# Altium schematic sheet AC56I99.RWA.230731.SchDoc
size 838 x 457 mm
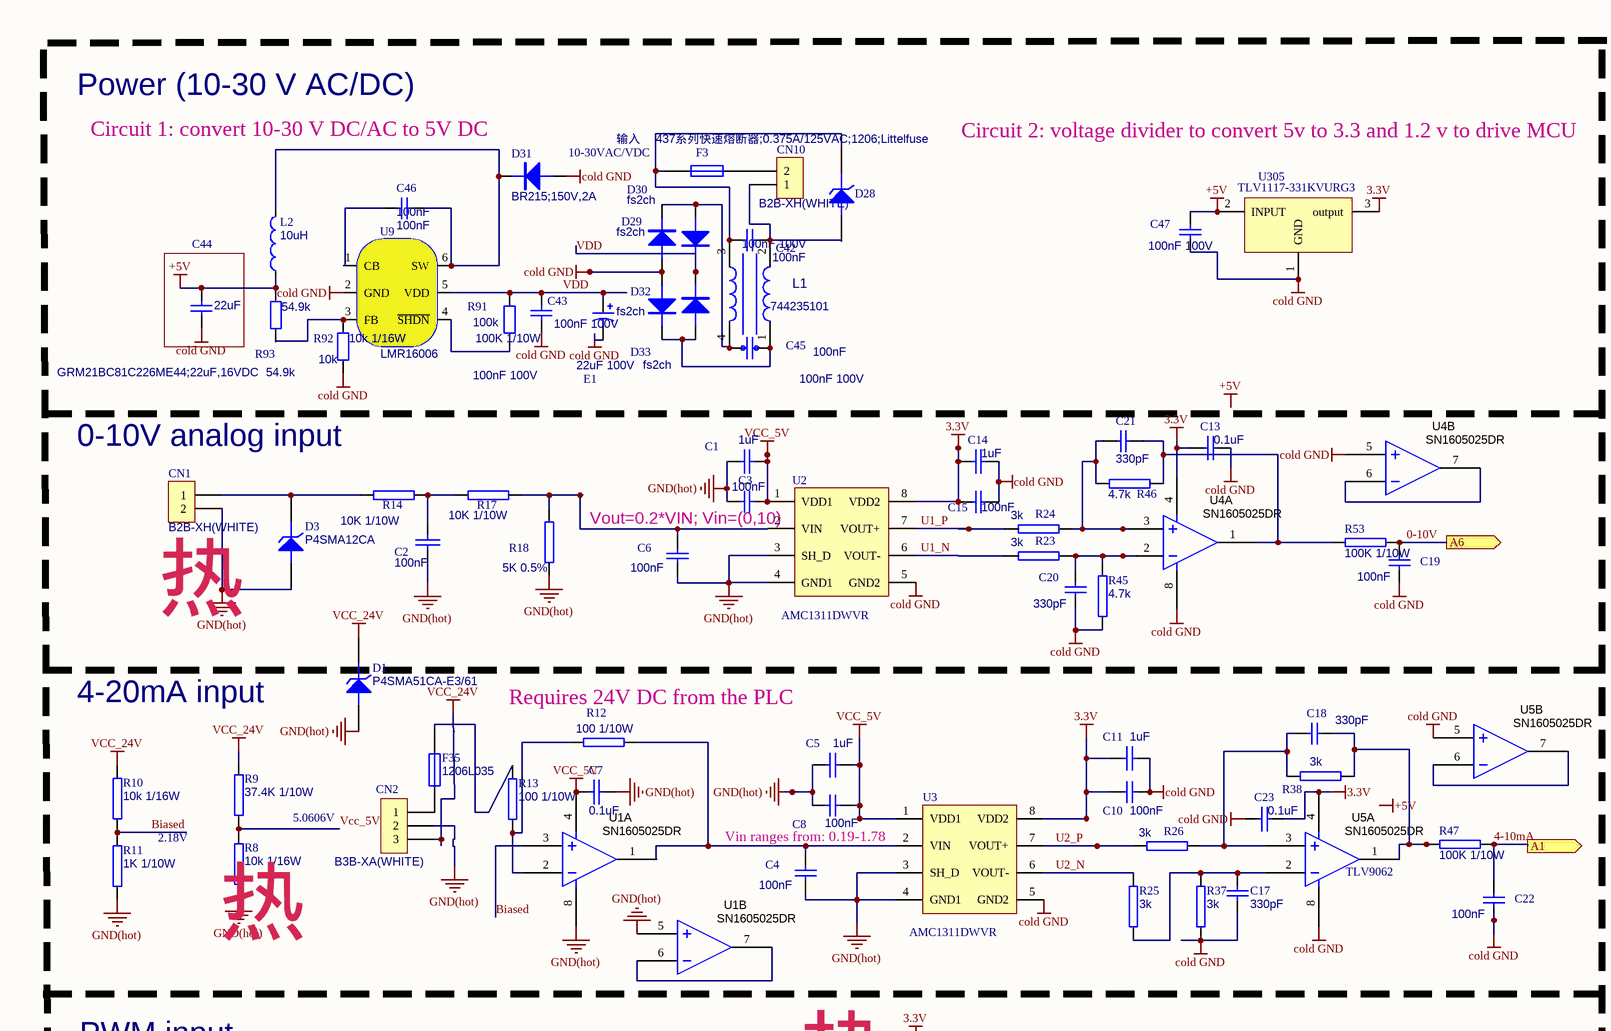
[diagram p0: AC56I99.RWA.230731.SchDoc, top left]
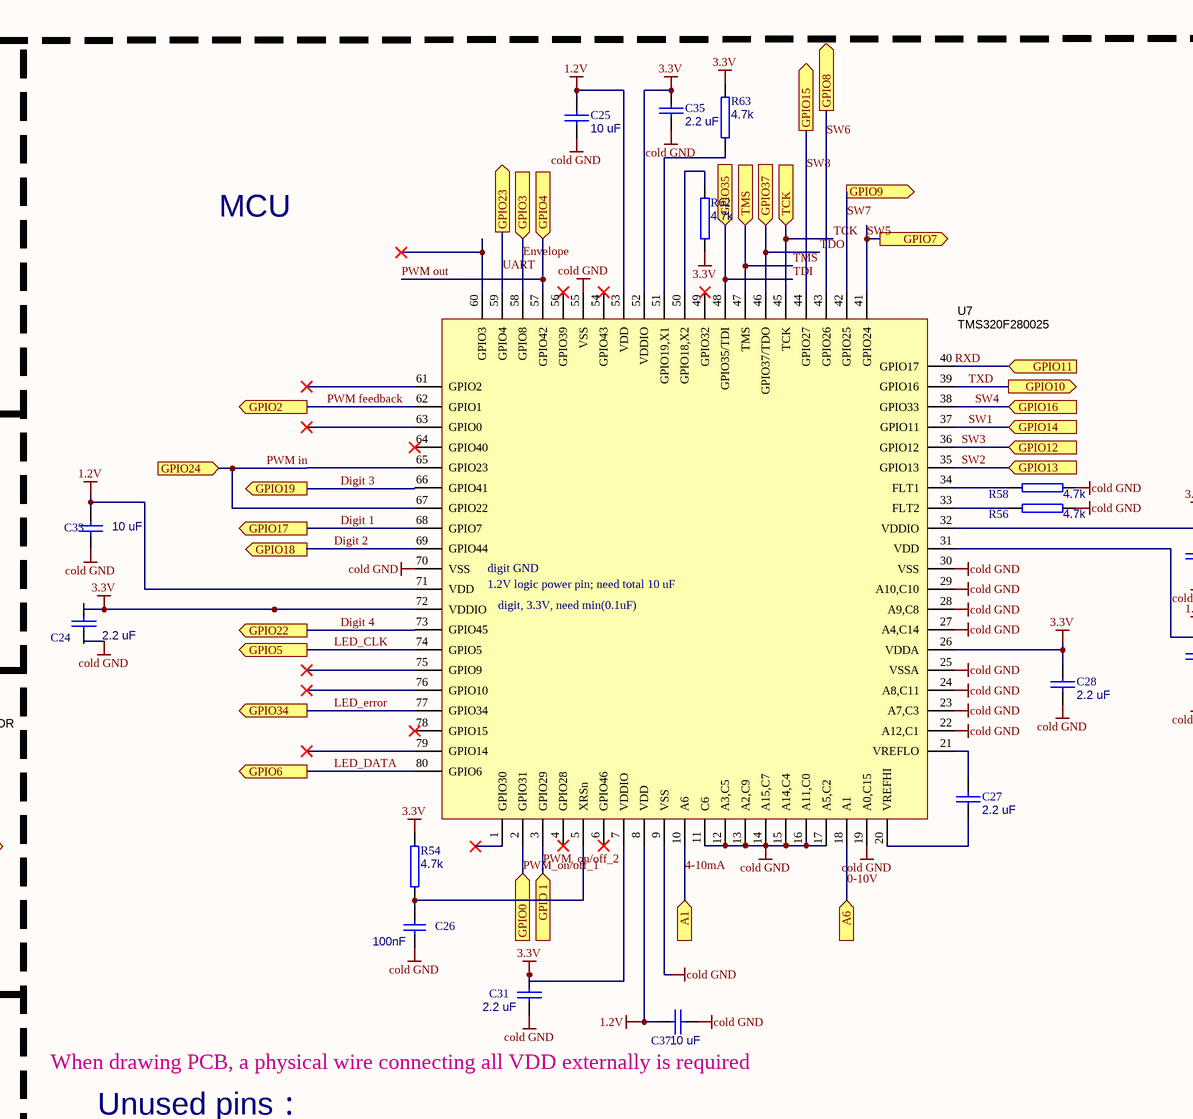
[diagram p1: AC56I99.RWA.230731.SchDoc, top middle]
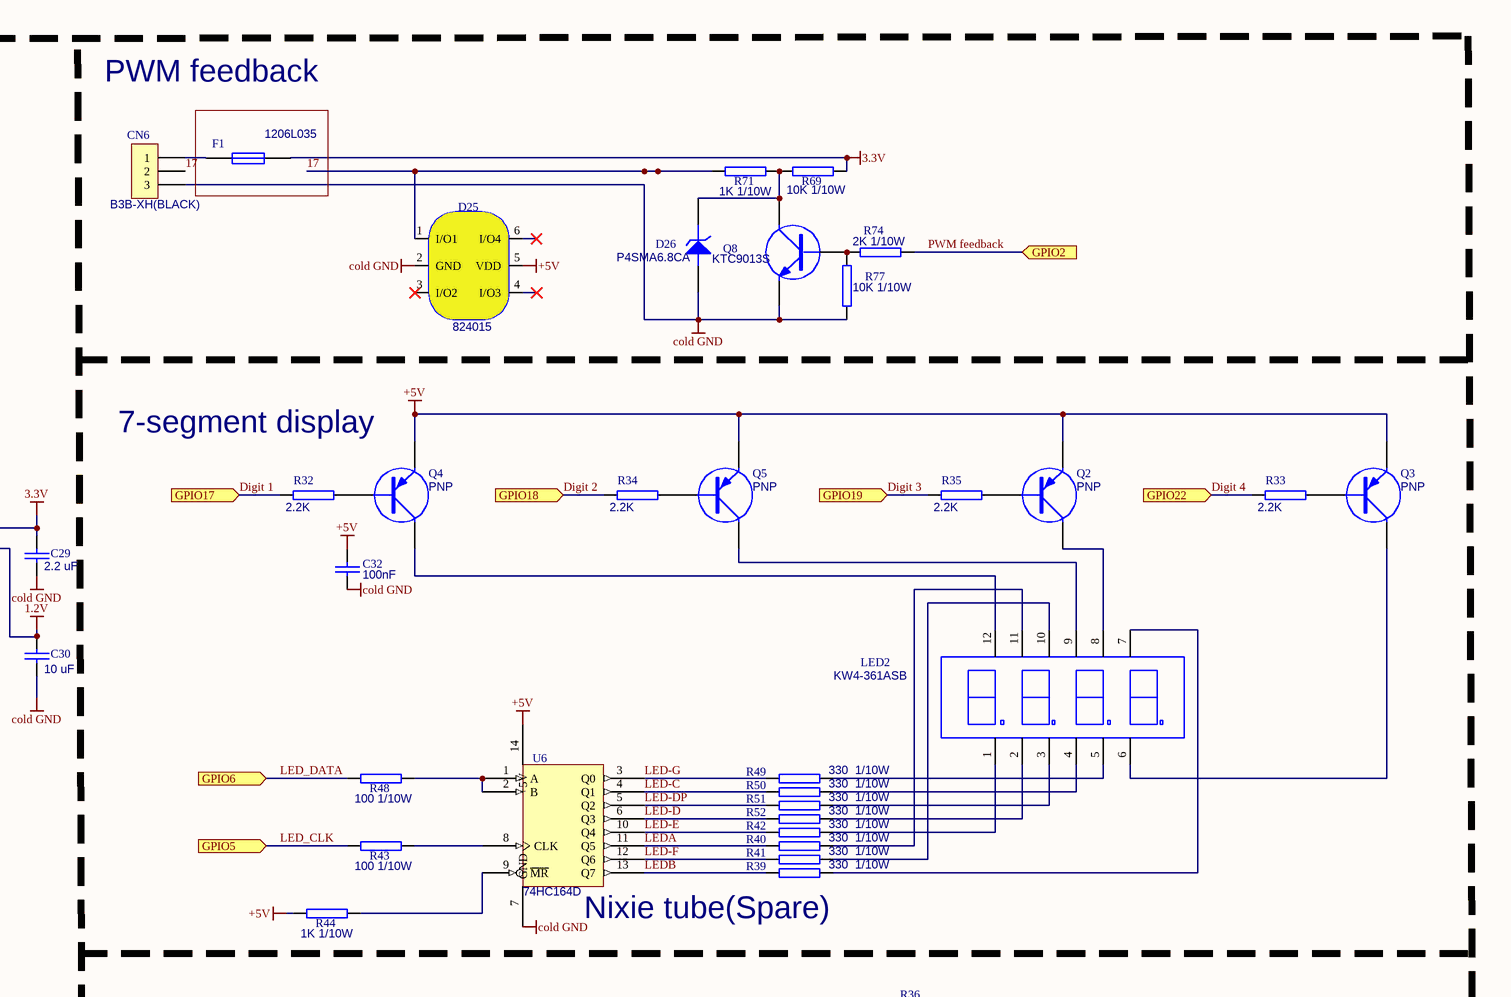
[diagram p2: AC56I99.RWA.230731.SchDoc, top right]
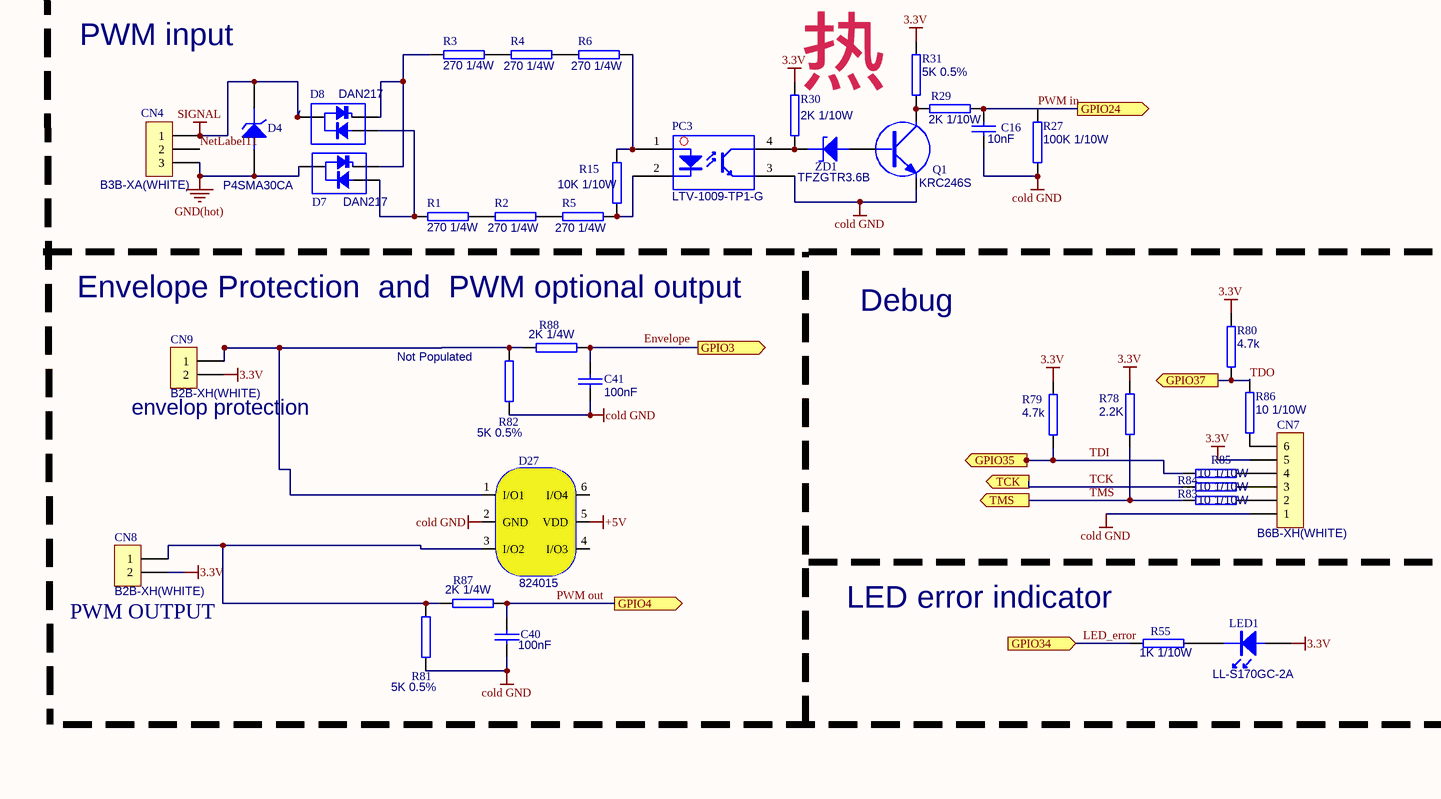
[diagram p3: AC56I99.RWA.230731.SchDoc, bottom left]
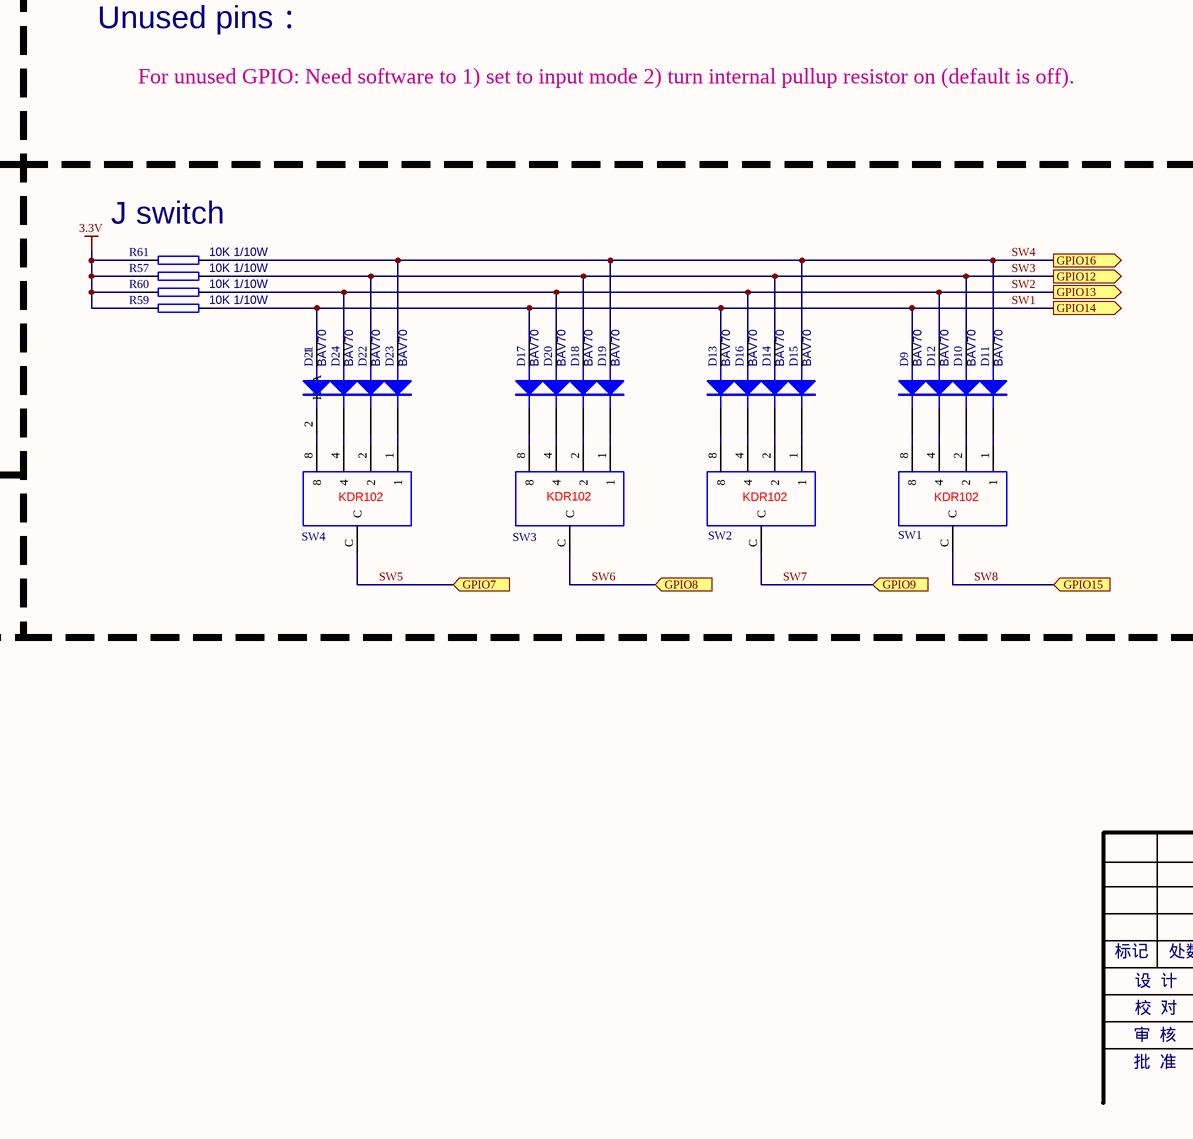
[diagram p4: AC56I99.RWA.230731.SchDoc, bottom middle]
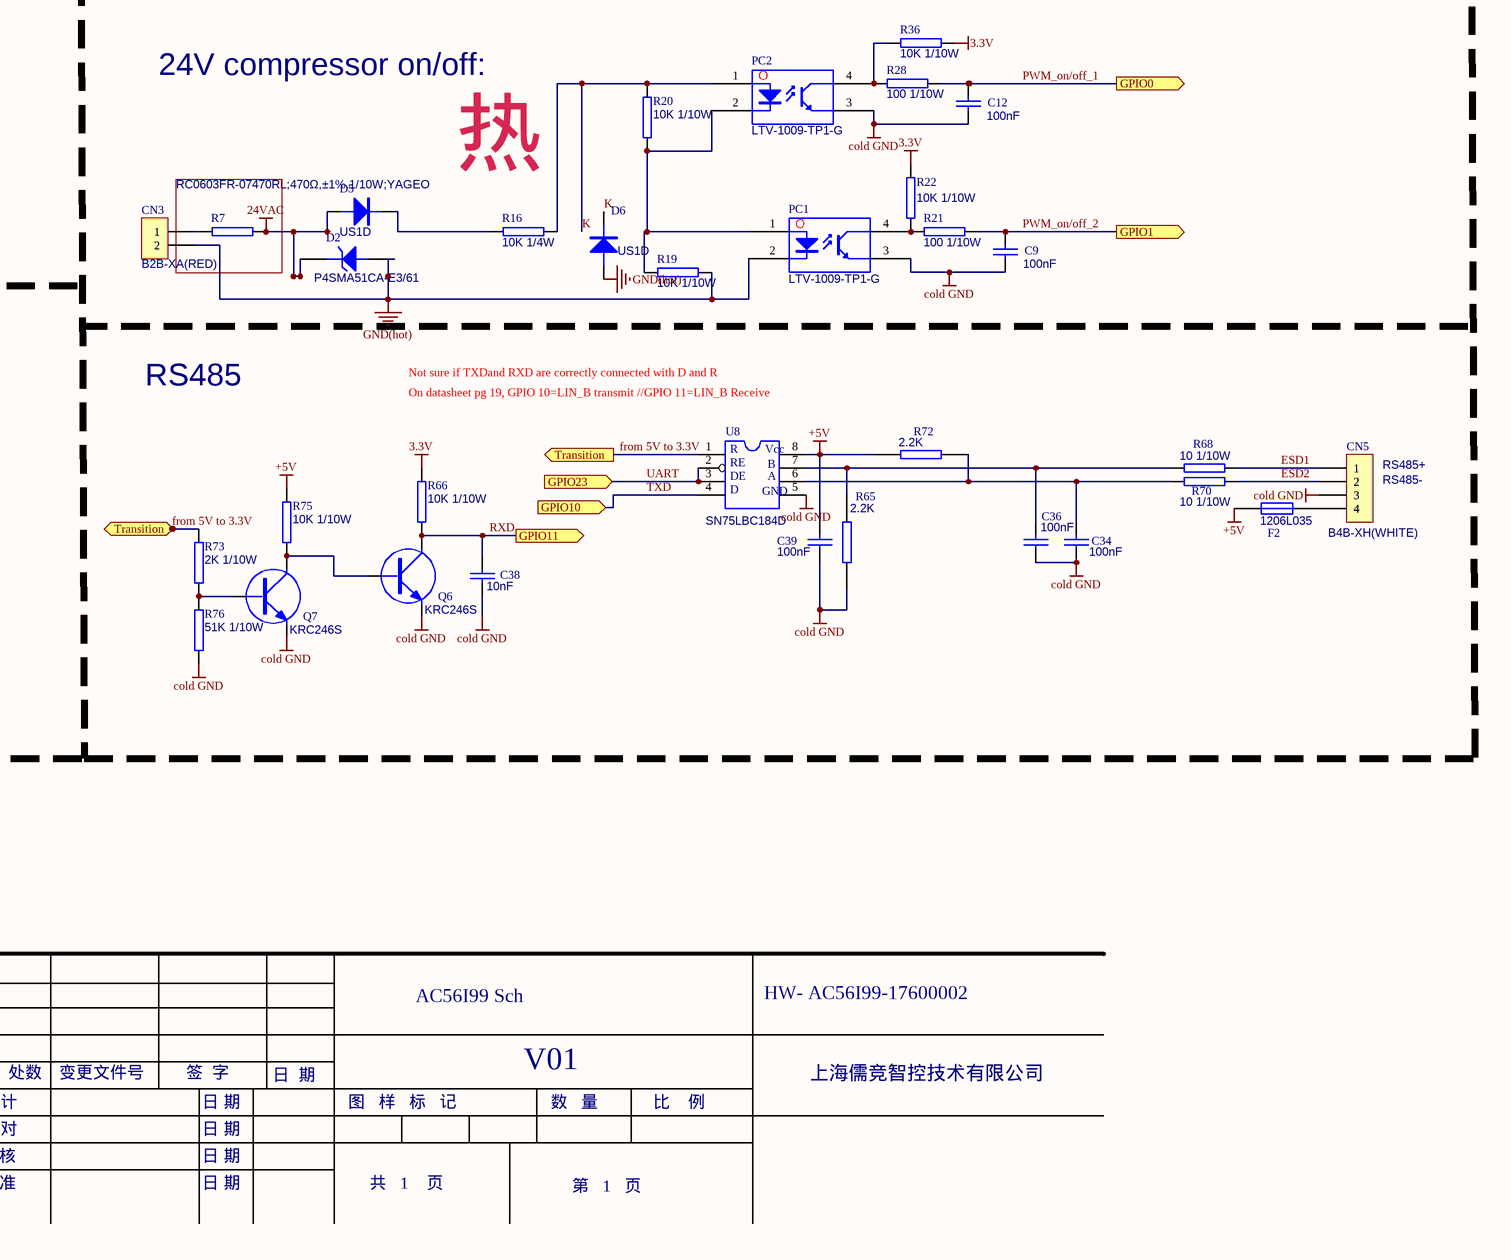
[diagram p5: AC56I99.RWA.230731.SchDoc, bottom right]

## Parts
C1  1uF  [0805-1]
C2  100nF  [0603-1]
C3  100nF  [0603-1]
C4  100nF  [0603-1]
C5  1uF  [0805-1]
C6  100nF  [0603-1]
C7  0.1uF  [0603-1]
C8  100nF  [0603-1]
C9  100nF  [0603-1]
C10  100nF  [0603-1]
C11  1uF  [0805-1]
C12  100nF  [0603-1]
C13  0.1uF  [0603-1]
C14  1uF  [0805-1]
C15  100nF  [0603-1]
C16  10nF  [0603-1]
C17  330pF  [0603-1]
C18  330pF  [0603-1]
C19  100nF  [0603-1]
C20  330pF  [0603-1]
C21  330pF  [0603-1]
C22  100nF  [0603-1]
C23  0.1uF  [0603-1]
C24  2.2 uF  [0603-1]
C25  10 uF  [0603-1]
C26  100nF  [0603-1]
C27  2.2 uF  [0603-1]
C28  2.2 uF  [0603-1]
C29  2.2 uF  [0603-1]
C30  10 uF  [0603-1]
C31  2.2 uF  [0603-1]
C32  100nF  [0603-1]
C33  10 uF  [0603-1]
C34  100nF  [0603-1]
C35  2.2 uF  [0603-1]
C36  100nF  [0603-1]
C37  10 uF  [0603-1]
C38  10nF  [0603-1]
C39  100nF  [0603-1]
C40  100nF  [0603-1]
C41  100nF  [0603-1]
C42  100nF 100V  value 100nF  [0805]
C43  100nF 100V  [0805]
C44  22uF  value GRM21BC81C226ME44;22uF,16VDC  [0805]
C45  100nF 100V  value 100nF  [0805]
C46  100nF  [0603-1]
C47  100nF 100V  [0805]
CN1  B2B-XH(WHITE)  [XH-2-1]
CN2  B3B-XA(WHITE)  [XH-3-1]
CN3  B2B-XA(RED)  [XH-2-1]
CN4  B3B-XA(WHITE)  [XH-3-1]
CN5  B4B-XH(WHITE)  [XH-4]
CN6  B3B-XH(BLACK)  [XH-3-1]
CN7  B6B-XH(WHITE)  [XH-6-1]
CN8  B2B-XH(WHITE)  [XH-2]
CN9  B2B-XH(WHITE)  [XH-2]
CN10  B2B-XH(WHITE)  [XH-2]
D1  P4SMA51CA-E3/61  [DIOD2]
D2  P4SMA51CA-E3/61  [DIOD2]
D3  P4SMA12CA  [DIOD2]
D4  P4SMA30CA  [DIOD2]
D5  US1D  [DIOD2]
D6  US1D  [DIOD2]
D7  DAN217  [SMD3]
D8  DAN217  [SMD3]
D9  BAV70  [SOT22-1]
D10  BAV70  [SOT22-1]
D11  BAV70  [SOT22-1]
D12  BAV70  [SOT22-1]
D13  BAV70  [SOT22-1]
D14  BAV70  [SOT22-1]
D15  BAV70  [SOT22-1]
D16  BAV70  [SOT22-1]
D17  BAV70  [SOT22-1]
D18  BAV70  [SOT22-1]
D19  BAV70  [SOT22-1]
D20  BAV70  [SOT22-1]
D21  BAV70  [SOT22-1]
D22  BAV70  [SOT22-1]
D23  BAV70  [SOT22-1]
D24  BAV70  [SOT22-1]
D25  824015  [SOT23-6L]
D26  P4SMA6.8CA  [DIOD2]
D27  824015  [SOT23-6L]
D28  (no value)  [DIOD2]
D29  fs2ch  [diod2]
D30  fs2ch  [DIOD2]
D31  BR215;150V,2A  [DIOD2]
D32  fs2ch  [DIOD2]
D33  fs2ch  [DIOD2]
E1  value 22uF 100V  [E8T1]
F1  1206L035  [1206]
F2  1206L035  [1206]
F3  437系列快速熔断器;0.375A/125VAC;1206;Littelfuse  [1206]
F35  1206L035  [1206]
L1  744235101  [744235101]
L2  10uH  [0806]
LED1  LL-S170GC-2A  [LED0805-1]
LED2  KW4-361ASB  [KW4-361ASB]
PC1  LTV-1009-TP1-G  [SOIC-4-Long]
PC2  LTV-1009-TP1-G  [SOIC-4-Long]
PC3  LTV-1009-TP1-G  [SOIC-4-Long]
Q1  KRC246S  [SOT-NPN]
Q2  PNP  [SOT-PNP]
Q3  PNP  [SOT-PNP]
Q4  PNP  [SOT-PNP]
Q5  PNP  [SOT-PNP]
Q6  KRC246S  [SOT-NPN]
Q7  KRC246S  [SOT-NPN]
Q8  KTC9013S  [SOT-NPN]
R1  270 1/4W  [1206]
R2  270 1/4W  [1206]
R3  270 1/4W  [1206]
R4  270 1/4W  [1206]
R5  270 1/4W  [1206]
R6  270 1/4W  [1206]
R7  RC0603FR-07470RL;470Ω,±1%,1/10W;YAGEO  [0603-1]
R8  10k 1/16W  [0603-1]
R9  37.4K 1/10W  [0603-1]
R10  10k 1/16W  [0603-1]
R11  1K 1/10W  [0603-1]
R12  100 1/10W  [0603-1]
R13  100 1/10W  [0603-1]
R14  10K 1/10W  [0603-1]
R15  10K 1/10W  [0603-1]
R16  10K 1/4W  [1206]
R17  10K 1/10W  [0603-1]
R18  5K 0.5%  [0603-1]
R19  10K 1/10W  [0603-1]
R20  10K 1/10W  [0603-1]
R21  100 1/10W  [0603-1]
R22  10K 1/10W  [0603-1]
R23  3k  [0603-1]
R24  3k  [0603-1]
R25  3k  [0603-1]
R26  3k  [0603-1]
R27  100K 1/10W  [0603-1]
R28  100 1/10W  [0603-1]
R29  2K 1/10W  [0603-1]
R30  2K 1/10W  [0603-1]
R31  5K 0.5%  [0603-1]
R32  2.2K  [0603-1]
R33  2.2K  [0603-1]
R34  2.2K  [0603-1]
R35  2.2K  [0603-1]
R36  10K 1/10W  [0603-1]
R37  3k  [0603-1]
R38  3k  [0603-1]
R39  330  1/10W  [0603-1]
R40  330  1/10W  [0603-1]
R41  330  1/10W  [0603-1]
R42  330  1/10W  [0603-1]
R43  100 1/10W  [0603-1]
R44  1K 1/10W  [0603-1]
R45  4.7k  [0603-1]
R46  4.7k  [0603-1]
R47  100K 1/10W  [0603-1]
R48  100 1/10W  [0603-1]
R49  330  1/10W  [0603-1]
R50  330  1/10W  [0603-1]
R51  330  1/10W  [0603-1]
R52  330  1/10W  [0603-1]
R53  100K 1/10W  [0603-1]
R54  4.7k  [0603-1]
R55  1K 1/10W  [0603-1]
R56  4.7k  [0603-1]
R57  10K 1/10W  [0603-1]
R58  4.7k  [0603-1]
R59  10K 1/10W  [0603-1]
R60  10K 1/10W  [0603-1]
R61  10K 1/10W  [0603-1]
R62  4.7k  [0603-1]
R63  4.7k  [0603-1]
R65  2.2K  [0603-1]
R66  10K 1/10W  [0603-1]
R68  10 1/10W  [0603-1]
R69  10K 1/10W  [0603-1]
R70  10 1/10W  [0603-1]
R71  1K 1/10W  [0603-1]
R72  2.2K  [0603-1]
R73  2K 1/10W  [0603-1]
R74  2K 1/10W  [0603-1]
R75  10K 1/10W  [0603-1]
R76  51K 1/10W  [0603-1]
R77  10K 1/10W  [0603-1]
R78  2.2K  [0603-1]
R79  4.7k  [0603-1]
R80  4.7k  [0603-1]
R81  5K 0.5%  [0603-1]
R82  5K 0.5%  [0603-1]
R83  10 1/10W  [0603-1]
R84  10 1/10W  [0603-1]
R85  10 1/10W  [0603-1]
R86  10 1/10W  [0603-1]
R87  2K 1/4W  [1206]
R88  2K 1/4W  [1206]
R91  100K 1/10W  value 100k  [0603-1]
R92  10k 1/16W  value 10k  [0603-1]
R93  54.9k  [0603-1]
SW1  KDR102  [KDR102*]
SW2  KDR102  [KDR102*]
SW3  KDR102  [KDR102*]
SW4  KDR102  [KDR102*]
U1  SN1605025DR  [SOIC-8]  (parts A,B of 2)
U2  AMC1311DWVR  [SOIC8-9mm]
U3  AMC1311DWVR  [SOIC8-9mm]
U4  SN1605025DR  [SOIC-8]  (parts A,B of 2)
U5  SN1605025DR  [SOIC-8]  (parts A,B of 2)
U6  74HC164D  [DIP14T]
U7  TMS320F280025  [LQFP80]
U8  SN75LBC184D  [soic8]
U9  LMR16006  [SOT23-6]
U305  TLV1117-331KVURG3  [TO-252]
ZD1  TFZGTR3.6B  [TFZ]

## Ports
A1 (in), A1 (out), A6 (in), A6 (out), GPIO0 (in), GPIO0 (out), GPIO1 (out), GPIO2 (in), GPIO2 (out), GPIO3 (in), GPIO3 (out), GPIO4 (in), GPIO4 (out), GPIO5 (in), GPIO5 (out), GPIO6 (in), GPIO6 (out), GPIO7 (in), GPIO7 (out), GPIO8 (in), GPIO8 (out), GPIO9 (in), GPIO9 (out), GPIO10 (in), GPIO10 (out), GPIO11 (in), GPIO11 (out), GPIO12 (in), GPIO12 (out), GPIO13 (in), GPIO13 (out), GPIO14 (in), GPIO14 (out), GPIO15 (in), GPIO15 (out), GPIO16 (in), GPIO16 (out), GPIO17 (in), GPIO17 (out), GPIO18 (in), GPIO18 (out), GPIO19 (in), GPIO19 (out), GPIO22 (in), GPIO22 (out), GPIO23 (in), GPIO23 (out), GPIO24 (in), GPIO24 (out), GPIO34 (in), GPIO34 (out), GPIO35 (in), GPIO35 (out), GPIO37 (in), GPIO37 (out), GPIO 1 (in), TCK (in), TCK (out), TMS (in), TMS (out), Transition (in), Transition (out)

## Nets
1.2V: C25.2 C30.2 C33.1 C37.1 U7.8(VDD) U7.31(VDD) U7.53(VDD) U7.71(VDD)
3.3V: C10.1 C11.1 C13.1 C14.1 C15.1 C23.2 C24.1 C28.2 C29.2 C31.1 C35.2 CN7.5 CN8.2 CN9.2 F1.2 LED1.A(nfdhfdg) R22.1 R30.1 R31.2 R36.2 R54.2 R57.2 R59.2 R60.2 R61.2 R62.2 R63.2 R66.2 R69.2 R78.2 R79.2 R80.2 U2.8(VDD2) U3.8(VDD2) U4.4 U5.4 U7.7(VDDIO) U7.26(VDDA) U7.32(VDDIO) U7.52(VDDIO) U7.72(VDDIO) U305.3(output)
24VAC: D2.K(A) D5.A R7.2
+5V: C32.1 C39.1 C44.1 C47.1 D25.5(VDD) D27.5(VDD) F2.1 L2.1 Q2.E Q3.E Q4.E Q5.E R44.1 R72.2 R75.2 R93.2 U6.14(+5V) U8.8 U305.2(INPUT)
cold GND: C9.2 C10.2 C11.2 C12.2 C13.2 C14.2 C15.2 C16.2 C17.1 C19.2 C20.2 C22.2 C23.1 C24.2 C25.1 C26.2 C28.1 C29.1 C30.1 C31.2 C32.2 C33.2 C34.2 C35.1 C36.2 C37.2 C38.2 C39.2 C40.2 C41.2 C43.1 C44.2 C47.2 CN5.3 CN6.3 CN7.1 D25.2(GND) D26.A D27.2(GND) D29.A D31.A D32.A E1.2 PC1.3 PC2.3 PC3.3 Q1.E Q6.E Q7.E Q8.E R27.1 R37.2 R45.1 R56.1 R58.1 R65.1 R76.1 R77.1 R81.2 R82.2 R92.1 U2.5(GND2) U3.5(GND2) U4.5 U4.8 U5.5 U5.8 U6.7(GND) U7.9(VSS) U7.11(C6) U7.12(A3,C5) U7.13(A2,C9) U7.14(A15,C7) U7.15(A14,C4) U7.16(A11,C0) U7.17(A5,C2) U7.19(A0,C15) U7.22(A12,C1) U7.23(A7,C3) U7.24(A8,C11) U7.25(VSSA) U7.27(A4,C14) U7.28(A9,C8) U7.29(A10,C10) U7.30(VSS) U7.55(VSS) U7.70(VSS) U8.5 U9.2(GND) U305.1(GND)
GND(hot): C1.1 C2.2 C3.1 C4.1 C5.1 C6.1 C7.1 C8.1 CN1.2 CN2.2 CN3.2 CN4.3 D1.A(K) D2.A(K) D3.A D4.A D6.A D7.2(K1A2) PC1.2 R8.1 R11.1 R18.1 R19.2 U1.5 U1.8 U2.3(SH_D) U2.4(GND1) U3.3(SH_D) U3.4(GND1)
SIGNAL: CN4.1 D4.K D8.2(K1A2)
Vcc_5V: C1.2 C3.2 C5.2 C7.2 C8.2 R8.2 R9.1 U1.4 U2.1(VDD1) U3.1(VDD1)
VCC_24V: CN2.3 D1.K(A) R9.2 R10.2
0-10V: C19.1 R53.2 U7.18(A1) ; port A6
4-10mA: C22.1 R47.2 U7.10(A6) ; port A1
17: CN6.2 D25.1(I/O1) R71.1
Biased: R10.1 R11.2 U1.3
Digit 1: R32.1 U7.68(GPIO7) ; port GPIO17
Digit 2: R34.1 U7.69(GPIO44) ; port GPIO18
Digit 3: R35.1 U7.66(GPIO41) ; port GPIO19
Digit 4: R33.1 U7.73(GPIO45) ; port GPIO22
Envelope: C41.1 R88.2 U7.58(GPIO8) ; port GPIO3
ESD1: CN5.1 R68.2
ESD2: CN5.2 R70.2
from 5V to 3.3V: R73.2 U8.1 ; port Transition
K: D6.K PC2.1 R16.1 R20.1
LED-C: R50.1 U6.4(Q1)
LED-D: R52.1 U6.6(Q3)
LED-DP: R51.1 U6.5(Q2)
LED-E: R42.1 U6.10(Q4)
LED-F: R41.1 U6.12(Q6)
LED-G: R49.1 U6.3(Q0)
LED_CLK: R43.1 U7.74(GPIO5) ; port GPIO5
LED_DATA: R48.1 U7.80(GPIO6) ; port GPIO6
LED_error: R55.1 U7.77(GPIO34) ; port GPIO34
LEDA: R40.1 U6.11(Q5)
LEDB: R39.1 U6.13(Q7)
NetLabel11: CN4.2
PWM feedback: R74.1 U7.62(GPIO1) ; port GPIO2
PWM in: C16.1 R27.2 R29.2 U7.65(GPIO23) U7.67(GPIO22) ; port GPIO24
PWM out: C40.1 R87.2 U7.57(GPIO42) ; port GPIO4
PWM_on/off_1: C12.1 R28.2 U7.2(GPIO31) ; port GPIO0
PWM_on/off_2: C9.1 R21.2 U7.3(GPIO29) ; port GPIO1, port GPIO 1
RXD: C38.1 Q6.C R66.1 U7.40(GPIO17) ; port GPIO11
SW1: D9.1(A) D13.1(A) D17.1(A) D21.1(A) R59.1 U7.37(GPIO11) ; port GPIO14
SW2: D12.1(A) D16.1(A) D20.1(A) D24.1(A) R60.1 U7.35(GPIO13) ; port GPIO13
SW3: D10.1(A) D14.1(A) D18.1(A) D22.1(A) R57.1 U7.36(GPIO12) ; port GPIO12
SW4: D11.1(A) D15.1(A) D19.1(A) D23.1(A) R61.1 U7.38(GPIO33) ; port GPIO16
SW5: SW4.C U7.41(GPIO24) ; port GPIO7
SW6: SW3.C U7.43(GPIO26) ; port GPIO8
SW7: SW2.C U7.42(GPIO25) ; port GPIO9
SW8: SW1.C U7.44(GPIO27) ; port GPIO15
TCK: R84.2 U7.45(TCK) ; port TCK
TDI: R79.1 R85.2 U7.48(GPIO35/TDI) ; port GPIO35
TDO: R80.1 R86.2 U7.46(GPIO37/TDO) ; port GPIO37
TMS: R78.1 R83.2 U7.47(TMS) ; port TMS
TXD: U7.39(GPIO16) U8.4 ; port GPIO10
U1_N: R23.1 U2.6(VOUT-)
U1_P: R24.1 U2.7(VOUT+)
U2_N: R25.2 U3.6(VOUT-)
U2_P: R26.1 U3.7(VOUT+)
UART: U7.59(GPIO4) U8.2 U8.3 ; port GPIO23
VDD: C43.2 D30.K D33.K E1.1 R91.2 U9.5(VDD)
NetC2_1: C2.1 R14.2 R17.1
NetC4_2: C4.2 R12.2 U1.1 U3.2(VIN)
NetC6_2: C6.2 R17.2 R18.2 U2.2(VIN)
NetC17_2: C17.2 R25.1 R37.1 U5.2
NetC18_1: C18.1 R26.2 R38.1 U5.3
NetC18_2: C18.2 R38.2 R47.1 U5.1
NetC20_1: C20.1 R23.2 R45.2 U4.2
NetC21_1: C21.1 R24.2 R46.1 U4.3
NetC21_2: C21.2 R46.2 R53.1 U4.1
NetC26_1: C26.1 R54.1 U7.5(XRSn)
NetC27_1: C27.1 U7.20(VREFHI)
NetC27_2: C27.2 U7.21(VREFLO)
NetC34_1: C34.1 R70.1 R72.1 U8.6
NetC36_1: C36.1 R65.2 R68.1 U8.7
NetC42_1: C42.1 CN10.1 D28.A L1.2
NetC42_2: C42.2 D28.K F3.1 L1.3
NetC45_1: C45.1 D32.K D33.A L1.1
NetC45_2: C45.2 D29.K D30.A L1.4
NetC46_1: C46.1 D31.K L2.2 U9.6(SW)
NetC46_2: C46.2 U9.1(CB)
NetCN1_1: CN1.1 D3.K R14.1
NetCN2_1: CN2.1 F35.1
NetCN3_1: CN3.1 R7.1
NetCN5_4: CN5.4 F2.2
NetCN6_1: CN6.1 F1.1
NetCN7_2: CN7.2 R83.1
NetCN7_3: CN7.3 R84.1
NetCN7_4: CN7.4 R85.1
NetCN7_6: CN7.6 R86.1
NetCN8_1: CN8.1 D27.3(I/O2) R81.1 R87.1
NetCN9_1: CN9.1 D27.1(I/O1) R82.1 R88.1
NetCN10_2: CN10.2 F3.2
NetD5_K: D5.K R16.2
NetD7_1: D7.1(A1) D8.1(A1) R1.1
NetD7_3: D7.3(K2) D8.3(K2) R3.1
NetD9_2: D9.2(K) SW1.8
NetD10_2: D10.2(K) SW1.2
NetD11_2: D11.2(K) SW1.1
NetD12_2: D12.2(K) SW1.4
NetD13_2: D13.2(K) SW2.8
NetD14_2: D14.2(K) SW2.2
NetD15_2: D15.2(K) SW2.1
NetD16_2: D16.2(K) SW2.4
NetD17_2: D17.2(K) SW3.8
NetD18_2: D18.2(K) SW3.2
NetD19_2: D19.2(K) SW3.1
NetD20_2: D20.2(K) SW3.4
NetD21_2: D21.2(K) SW4.8
NetD22_2: D22.2(K) SW4.2
NetD23_2: D23.2(K) SW4.1
NetD24_2: D24.2(K) SW4.4
NetD26_K: D26.K Q8.C R69.1 R71.2
NetF35_2: F35.2 R13.1
NetLED1_K: LED1.K R55.2
NetLED2_1: LED2.1 R42.2
NetLED2_2: LED2.2 R52.2
NetLED2_3: LED2.3 R51.2
NetLED2_4: LED2.4 R50.2
NetLED2_5: LED2.5 R49.2
NetLED2_6: LED2.6 Q3.C
NetLED2_7: LED2.7 R39.2
NetLED2_8: LED2.8 Q2.C
NetLED2_9: LED2.9 Q5.C
NetLED2_10: LED2.10 R41.2
NetLED2_11: LED2.11 R40.2
NetLED2_12: LED2.12 Q4.C
NetPC1_1: PC1.1 PC2.2 R19.1 R20.2
NetPC1_4: PC1.4 R21.1 R22.2
NetPC2_4: PC2.4 R28.1 R36.1
NetPC3_1: PC3.1 R6.2 R15.1
NetPC3_2: PC3.2 R5.2 R15.2
NetPC3_4: PC3.4 R30.2 ZD1.2(K)
NetQ1_B: Q1.B ZD1.1(A)
NetQ1_C: Q1.C R29.1 R31.1
NetQ2_B: Q2.B R35.2
NetQ3_B: Q3.B R33.2
NetQ4_B: Q4.B R32.2
NetQ5_B: Q5.B R34.2
NetQ6_B: Q6.B Q7.C R75.1
NetQ7_B: Q7.B R73.1 R76.2
NetQ8_B: Q8.B R74.2 R77.2
NetR1_2: R1.2 R2.1
NetR2_2: R2.2 R5.1
NetR3_2: R3.2 R4.1
NetR4_2: R4.2 R6.1
NetR12_1: R12.1 R13.2 U1.2
NetR43_2: R43.2 U6.8(CLK)
NetR44_2: R44.2 U6.9(~{MR})
NetR48_2: R48.2 U6.1(A) U6.2(B)
NetR56_2: R56.2 U7.33(FLT2)
NetR58_2: R58.2 U7.34(FLT1)
NetR62_1: R62.1 U7.50(GPIO18,X2)
NetR63_1: R63.1 U7.51(GPIO19,X1)
NetR91_1: R91.1 U9.4(~{SHDN})
NetR92_2: R92.2 R93.1 U9.3(FB)
NetU1_6: U1.6 U1.7
NetU4_6: U4.6 U4.7
NetU5_6: U5.6 U5.7

Not connected (* = marked no-connect by the designer): D25 3(I/O2)* 4(I/O3)* 6(I/O4)*; D27 4(I/O3) 6(I/O4); U7 1(GPIO30)* 4(GPIO28)* 6(GPIO46)* 49(GPIO32)* 54(GPIO43)* 56(GPIO39)* 60(GPIO3)* 61(GPIO2)* 63(GPIO0)* 64(GPIO40)* 75(GPIO9)* 76(GPIO10)* 78(GPIO15)* 79(GPIO14)*

## Notes on the sheet
- PWM feedback
- Power (10-30 V AC/DC)
- (near D31) Circuit 1: convert 10-30 V DC/AC to 5V DC
- (near D31) 10-30VAC/VDC
- 输入
- Circuit 2: voltage divider to convert 5v to 3.3 and 1.2 v to drive MCU
- MCU
- 0-10V analog input
- (near Q4) 7-segment display
- (near U2) Vout=0.2*VIN; Vin=(0,10)
- (near CN1) 热
- (near U7) digit GND
- (near U7) 1.2V logic power pin; need total 10 uF
- (near U7) digit, 3.3V, need min(0.1uF)
- 4-20mA input
- (near R12) Requires 24V DC from the PLC
- 5.0606V
- 2.18V
- (near U3) Vin ranges from: 0.19-1.78
- (near U5) TLV9062
- (near R8) 热
- (near U6) Nixie tube(Spare)
- PWM input
- (near R30) 热
- (near C37) When drawing PCB, a physical wire connecting all VDD externally is required
- 24V compressor on/off:
- Unused pins：
- (near CN3) For unused GPIO: Need software to 1) set to input mode 2) turn internal pullup resistor on (default is off).
- (near D5) 热
- Envelope Protection  and  PWM optional output
- (near R82) Not Populated
- Debug
- J switch
- RS485
- (near CN9) envelop protection
- (near CN5) RS485+
- (near CN5) RS485-
- (near CN8) PWM OUTPUT
- (near R55) LED error indicator
- AC56I99 Sch
- HW- AC56I99-17600002
- 标记
- 处数
- 变更文件号
- 签  字
- 日  期
- V01
- 上海儒竞智控技术有限公司
- 设  计
- 校  对
- 日 期
- 图   样   标   记
- 数   量
- 比    例
- 审  核
- 批  准
- 共   1    页
- 第   1   页
- Labels drawn without touching a wire or pin: +5V, Envelope, Not sure if TXDand RXD are correctly connected with D and R, On datasheet pg 19, GPIO 10=LIN_B transmit //GPIO 11=LIN_B Receive
- (in symbol 75176) R; Vcc; RE; B; DE; A; D; GND

## Library data of the parts
C1 C2 C5 C7 C9 C11-C14 C16 C23-C25 C27-C41 = CAP: Capacitor
C3 C4 C6 C8 C10 C15 C17-C22 C26 C42-C47 = Cap: Capacitor
  C3 C4 C6 C8 C10 C15 C17-C22 C26 C47: Published: *; Publisher: *; Manufacturer: *; Class: *; SubClass: *; Value: *
  C42 C44 C45: Published: 8-Jun-2000; LatestRevisionDate: 17-Jul-2002; LatestRevisionNote: Re-released for DXP Platform.; PackageReference: RAD-0.3; Publisher: Altium Limited
  C43: Published: 8-Jun-2000; LatestRevisionDate: 17-Jul-2002; LatestRevisionNote: Re-released for DXP Platform.; PackageReference: RAD-0.3; Publisher: Altium Limited; Value: 100nF 100V
  C46: Published: 8-Jun-2000; LatestRevisionDate: 17-Jul-2002; LatestRevisionNote: Re-released for DXP Platform.; PackageReference: RAD-0.3; Publisher: Altium Limited; Value: 100nF
CN1 CN3 CN8-CN10 = CON2: Connector
CN2 CN4 CN6 = CON3: Connector
CN5 = CON4: Connector
CN7 = CON6: Connector
D1-D4 D26 D28 = ZENER3: Zener Diode
D5 D6 D29-D33 = DIODE
D7 D8 = DIODE2
D9-D24 = DIODE: BAV70;贴片开关二极管;封装SOT-23;固锝
D25 D27 U9 = TVS
E1 = Cap Pol1: Polarized Capacitor (Radial); Published: 8-Jun-2000; LatestRevisionDate: 17-Jul-2002; LatestRevisionNote: Re-released for DXP Platform.; PackageReference: RB7.6-15; Publisher: Altium Limited
F1-F3 F35 = FUSE1: Fuse
L2 = INDUCTOR1
LED1 = LED
PC1-PC3 = OPTOISO: HCPL-817-56BE;SOP-4;AVAGO
Q1 Q6 Q7 = NPN
Q8 = NPN: NPN Transistor
R1-R63 R65 R66 R68-R88 = RES2
R91-R93 = Res2: Resistor; Published: 8-Jun-2000; LatestRevisionDate: 17-Jul-2002; LatestRevisionNote: Re-released for DXP Platform.; PackageReference: AXIAL-0.4; Publisher: Altium Limited
  R93: Value: 54.9k
SW1-SW4 = COMPONENT_8: KDR102;10位旋转型拨码开关,黑色,-30℃~+70℃;OTAX
U1 U4 U5 = LM124
U2 U3 = AMC1311
U6 = 74ALS164
U8 = 75176
U305 = VOLTREG
ZD1 = ZENER2: Zener Diode